# Altium schematic sheet 12v_Outputs.SchDoc
size A4 portrait; Organization: Altium Limited; Address1: L3, 12a Rodborough Rd; Address2: Frenchs Forest; Address3: NSW; Address4: Australia 2086
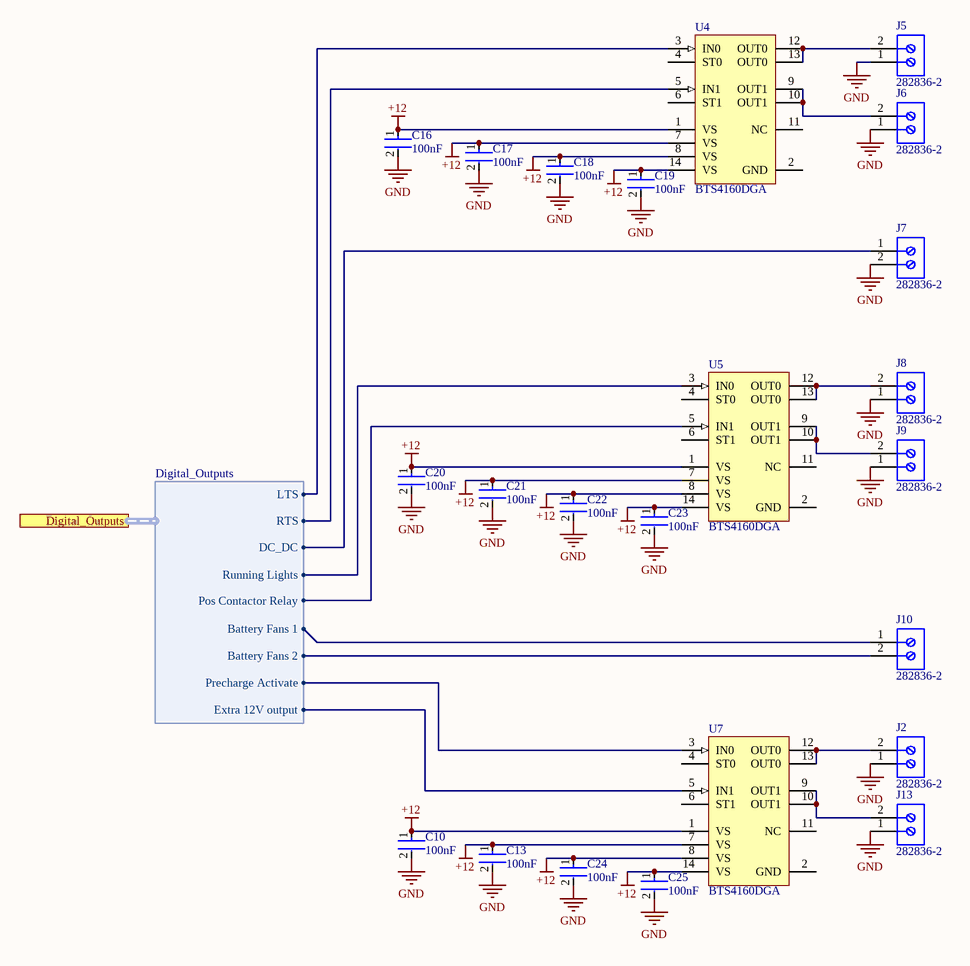
[diagram p0: 12v_Outputs.SchDoc]

## Parts
C10  100nF  [Kemet_C0603_IPC_A]
C13  100nF  [Kemet_C0603_IPC_A]
C16  100nF  [Kemet_C0603_IPC_A]
C17  100nF  [Kemet_C0603_IPC_A]
C18  100nF  [Kemet_C0603_IPC_A]
C19  100nF  [Kemet_C0603_IPC_A]
C20  100nF  [Kemet_C0603_IPC_A]
C21  100nF  [Kemet_C0603_IPC_A]
C22  100nF  [Kemet_C0603_IPC_A]
C23  100nF  [Kemet_C0603_IPC_A]
C24  100nF  [Kemet_C0603_IPC_A]
C25  100nF  [Kemet_C0603_IPC_A]
J2  282836-2  [TECO-282836-2_V]
J5  282836-2  [TECO-282836-2_V]
J6  282836-2  [TECO-282836-2_V]
J7  282836-2  [TECO-282836-2_V]
J8  282836-2  [TECO-282836-2_V]
J9  282836-2  [TECO-282836-2_V]
J10  282836-2  [TECO-282836-2_V]
J13  282836-2  [TECO-282836-2_V]
U4  BTS4160DGA  [INF-PG-DSO-14-37_N]
U5  BTS4160DGA  [INF-PG-DSO-14-37_N]
U7  BTS4160DGA  [INF-PG-DSO-14-37_N]

## Ports
Digital_Outputs (harness Digital_Outputs)

## Harnesses
Digital_Outputs: LTS, RTS, DC_DC, Running Lights, Pos Contactor Relay, Battery Fans 1, Battery Fans 2, Precharge Activate, Extra 12V output

## Nets
+12: C10.1 C13.1 C16.1 C17.1 C18.1 C19.1 C20.1 C21.1 C22.1 C23.1 C24.1 C25.1 U4.1(VS) U4.7(VS) U4.8(VS) U4.14(VS) U5.1(VS) U5.7(VS) U5.8(VS) U5.14(VS) U7.1(VS) U7.7(VS) U7.8(VS) U7.14(VS)
GND: C10.2 C13.2 C16.2 C17.2 C18.2 C19.2 C20.2 C21.2 C22.2 C23.2 C24.2 C25.2 J2.1 J5.1 J6.1 J7.2 J8.1 J9.1 J13.1
NetJ2_2: J2.2 U7.12(OUT0) U7.13(OUT0)
NetJ5_2: J5.2 U4.12(OUT0) U4.13(OUT0)
NetJ6_2: J6.2 U4.9(OUT1) U4.10(OUT1)
NetJ7_1: J7.1 ; port Digital_Outputs.DC_DC
NetJ8_2: J8.2 U5.12(OUT0) U5.13(OUT0)
NetJ9_2: J9.2 U5.9(OUT1) U5.10(OUT1)
NetJ10_1: J10.1 ; port Digital_Outputs.Battery Fans 1
NetJ10_2: J10.2 ; port Digital_Outputs.Battery Fans 2
NetJ13_2: J13.2 U7.9(OUT1) U7.10(OUT1)
NetU4_3: U4.3(IN0) ; port Digital_Outputs.LTS
NetU4_5: U4.5(IN1) ; port Digital_Outputs.RTS
NetU5_3: U5.3(IN0) ; port Digital_Outputs.Running Lights
NetU5_5: U5.5(IN1) ; port Digital_Outputs.Pos Contactor Relay
NetU7_3: U7.3(IN0) ; port Digital_Outputs.Precharge Activate
NetU7_5: U7.5(IN1) ; port Digital_Outputs.Extra 12V output

Not connected (* = marked no-connect by the designer): U4 2(GND) 4(ST0) 6(ST1) 11(NC); U5 2(GND) 4(ST0) 6(ST1) 11(NC); U7 2(GND) 4(ST0) 6(ST1) 11(NC)

## Notes on the sheet
- Title
- Size:
- Date:
- A4
- Number:
- Time:
- Revision:
- Sheet
- of
- File:

## Library data of the parts
C10 C13 C16-C25 = C0603C104K5RACTU: CAP CER 0.1UF 100NF 50V X7R 0603 C0603C104K5RACTU
J2 J5-J10 J13 = CMP-1684-00017-1: Female Header, Pitch 5 mm, 1 x 2 Position, Height 10 mm, Tail Length 3.5 mm, Rohs, Bulk; Manufacturer: TE Connectivity; Wire Gauge: 16-30AWG; Product Training Modules: Wire-to-BoardEurostyleTerminalBlocks; Clamp Material - Plating: Brass-NickelPlated; Voltage: 300V; Mating Orientation: HorizontalwithBoard; Current: 13.5A; Pitch: 0.197"(5.00mm); Screw Thread: M3; 3D Model: 282836-2.pdf; Other Names: 5ULV-02B / A98076; Dynamic Catalog: BuchananSeries; Number of Levels: 1; Torque - Screw: 0.68Nm(6Lb-In); Featured Product: EurostyleTerminalBlockConnectors; Positions Per Level: 2; Wire Termination: Screw-RisingCageClamp; Datasheet URL: http://www.te.com.cn/commerce/DocumentDelivery/DDEController?Action=showdoc&DocId=Catalog+Section%7F1308389_EUROSTYLE_TERMINAL_BLOCKS%7F0607%7Fpdf%7FEnglish%7FENG_CS_1308389_EUROSTYLE_TERMINAL_BLOCKS_0607.pdf%7F282836-2; Color: Green; Family: TerminalBlocks-WiretoBoard; RoHS Information: 282836-2StatementofCompliance; Standard Package: 300; Contact Material - Plating: Brass-TinPlated; Manufacturer URL: http://www.te.com; Housing Material: Polyamide(PA66),Nylon6/6; Features: Interlocking(Side); Package Description: Female Header, Pitch 5 mm, 1 x 2 Position, Height 10 mm, Tail Length 3.5 mm; Mounting Type: ThroughHole; Package Reference: THD; Packaging: Bulk; Series: Buchanan; Category: Connectors,Interconnects; Screw Material - Plating: Brass-NickelPlated
U4 U5 U7 = BTS4160DGA: Smart High-Side Power Switch, 2 Channels, 1.7 A Load Current, -40 to 150 degC, PG-DSO-14-37, Reel, Green; Manufacturer: Infineon; Group: Automotive Qualified; RON(max) @ 150degreesC: 320 mOhm; Recommended Operating Voltage Min.: 5.5 V; Recommended Operating Voltage Max.: 20 V; Green: TRUE; toff (max): 270 us; Load Current (typ): 1.7 A; ton (max): 250 us; RON @ 25degreesC: 160 mOhm; Ptot (max): 1.4 W; Channels: 2; PartNumber: BTS4160DGA; ComponentLink1Description: Manufacturer URL; ComponentLink2Description: Datasheet; DatasheetVersion: Rev. 1.0; ComponentLink3URL: http://www.infineon.com/dgdl/BTS723GWDS11_2007_09_25.pdf?folderId=db3a304314dca389011537739e37155f&fileId=db3a304331c8f8560131dbfec21b0da9&sId=db3a30443d67b5ca013d854df2f133e5; ComponentLink1URL: http://www.infineon.com/; Packing: Reel; ComponentLink2URL: http://www.infineon.com/dgdl/BTS+4160DGA_DS2008_03_18_neu.pdf?folderId=db3a304314dca389011537739e37155f&fileId=db3a30431a5c32f2011a957ab5875685&sId=db3a30433d68e984013d7cba76cc57cb; ComponentLink3Description: Package Specification; PackageVersion: Sep-07; Halogen-free: TRUE; Mounting Technology: Surface Mount; PackageReference: PG-DSO-14-37; PackageDescription: 14-Pin Plastic (Green) Dual Small Outline Package, 8.65 x 3.9 mm Body, 1.27 mm Pitch